# EAGLE design MPU9150 Breakout (EAGLE 6.2)
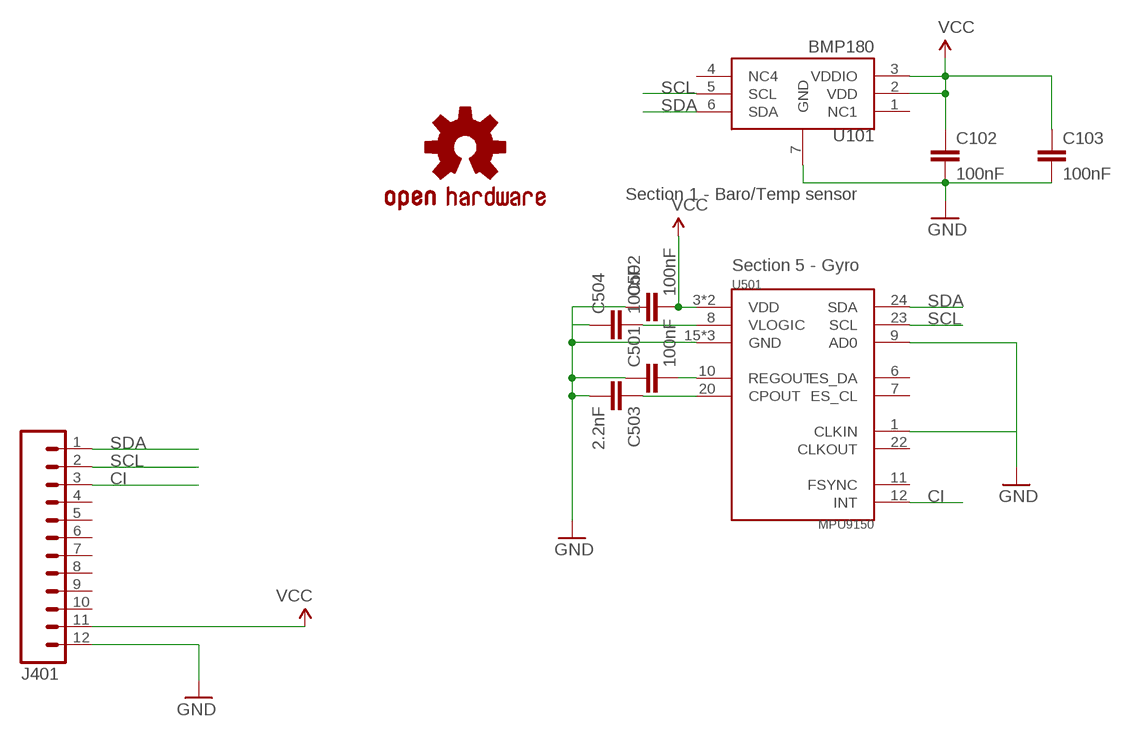
[diagram p0: schematic, sheet 1]

## Parts
C102  100nF  CAP0603-CAP  [0603-CAP]
C103  100nF  CAP0603-CAP  [0603-CAP]
C501  100nF  CAP0603-CAP  [0603-CAP]
C502  100nF  CAP0603-CAP  [0603-CAP]
C503  2.2nF  CAP0603-CAP  [0603-CAP]
C504  100nF  CAP0603-CAP  [0603-CAP]
J401  M12PTH  [1X12]
U101  BMP180  [BMP180]
U501  MPU9150  [LLGA24]
U$2  OSHW-LOGOS  [OSHW-LOGO-S]

## Nets
CI: J401.3 U501.12(INT)
GND: C102.2 C103.2 C501.1 C502.1 C503.2 C504.1 J401.12 U101.7(GND) U501.1(CLKIN) U501.9(AD0) U501.15(GND) U501.17(GND) U501.18(GND)
N$3: C503.1 U501.20(CPOUT)
N$5: C501.2 U501.10(REGOUT)
N$7 [POWER]: C504.2 U501.8(VLOGIC)
SCL: J401.2 U101.5(SCL) U501.23(SCL)
SDA: J401.1 U101.6(SDA) U501.24(SDA)
VCC [POWER]: C102.1 C103.1 C502.2 J401.11 U101.2(VDD) U101.3(VDDIO) U501.3(VDD) U501.13(VDD)
Unconnected: J401.4 J401.5 J401.6 J401.7 J401.8 J401.9 J401.10 U101.1(NC1) U101.4(NC4) U501.6(ES_DA) U501.7(ES_CL) U501.11(FSYNC) U501.22(CLKOUT)

## Notes on the sheet
- Section 1 - Baro/Temp sensor
- Section 5 - Gyro

## Library data of the parts
C102 C103 C501 C502 C504 = SparkFun:CAP: Capacitor Standard 0603 ceramic capacitor, and 0.1" leaded capacitor.; DIGIKEY: 445-1316-1-ND
C503 = SparkFun:CAP: Capacitor Standard 0603 ceramic capacitor, and 0.1" leaded capacitor.; DIGIKEY: 445-5132-1-ND
J401 = SparkFun:M12: Header 12 Standard 12-pin 0.1" header. Use with straight break away headers (SKU : PRT-00116), right angle break away headers (PRT-00553), swiss pins (PRT-00743), machine pins (PRT-00117), and female headers (PRT-00115).; DIGIKEY: $NOPART
U101 = KwanSystems:BMP180; DIGIKEY: 828-1027-1-ND
U501 = KwanSystems:MPU9150
U$2 = SparkFun:OSHW-LOGO: Open Source Hardware Logo This logo indicates the piece of hardware it is found on incorporates a OSHW license and/or adheres to the definition of open source hardware found here: http://freedomdefined.org/OSHW; DIGIKEY: $NOPART

## Net classes
0 default: width 0.152 mm, drill 0.33 mm, clearance 0.152 mm
1 POWER: width 0.152 mm, drill 0.33 mm, clearance 0.152 mm
2 hv: width 0.152 mm, drill 0.33 mm, clearance 0.152 mm

## Board
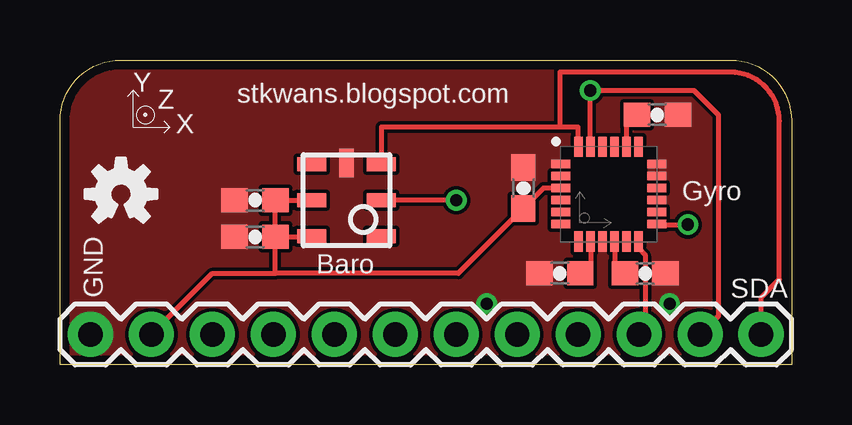
[diagram p1: board, top side]
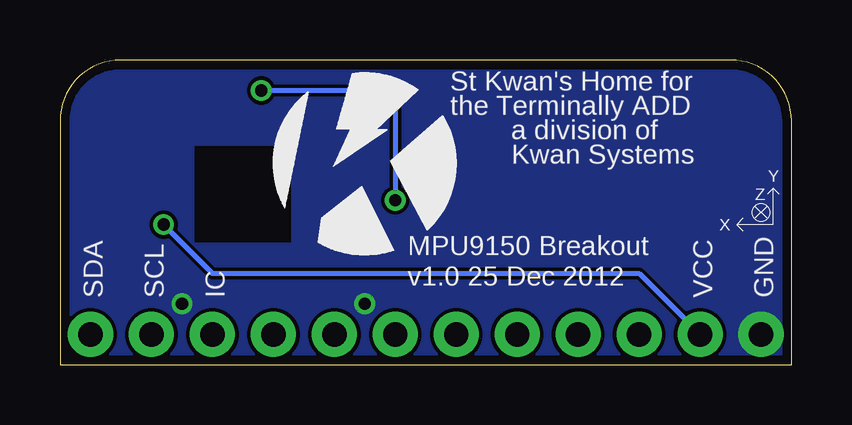
[diagram p2: board, bottom side, seen from below]

Size 30.48 x 12.7 mm. Coordinates in mm from the lower left corner, seen from the top.
Outline: 0,0 0,10.16 arc-90 2.54,12.7 27.94,12.7 arc-90 30.48,10.16 30.48,0 0,0
Copper layers (1*16): Top 0.0356mm / dielectric 1.5011mm / Bottom 0.0356mm
Design rules: minimum track width 6mil, minimum drill 13mil, track to track 6mil, track to pad 6mil, pad to pad 6mil, via to via 6mil, smd to smd 6mil, copper to edge 15mil, drill to drill 6mil, minimum pad ring 7mil, minimum via ring 7mil, stop-mask expansion 4mil, vias tented up to drill 14mil, thermal gap 10mil
vRestrict: area 0.8,2.8 to 1.8,4.8; area 26.2,3.6 to 26.9,4.8; area 27.9,2.8 to 30,3.6; area 28.7,3.6 to 29.5,4.8; area 2,10.4 to 14.2,12.2; area 3,8.4 to 11.7,10.2; area 0.5,6.3 to 1,8.6; area 1,5.8 to 1.5,7.4; area 1.5,5.6 to 2.8,6.1; area 0.5,5.8 to 1.3,7.9; area 14,5.8 to 16.5,10.4; area 15.5,8.4 to 19.1,12.2; 2 more areas

### Footprints (pad centres in the part's own frame; a part is rotated, then mirrored left to right if it is on the bottom)
0603-CAP = smd 1.1 x 1: 1 -0.85,0; 2 0.85,0
1X12 = drill 1.016 pad 1.88: 1 0,0; 2 2.54,0; 3 5.08,0; 4 7.62,0; 5 10.16,0; 6 12.7,0; 7 15.24,0; 8 17.78,0; 9 20.32,0; 10 22.86,0; 11 25.4,0; 12 27.94,0
BMP180 = smd 0.6 x 1.2: 1 1.5,1.45; 2 0,1.45; 3 -1.5,1.45; 4 -1.5,-1.45; 5 0,-1.45; 6 1.5,-1.45 | smd 1.2 x 0.6: 7 1.55,0
LLGA24 = smd 0.8 x 0.35: 1 -2,1.25; 2 -2,0.75; 3 -2,0.25; 4 -2,-0.25; 5 -2,-0.75; 6 -2,-1.25; 13 2,-1.25; 14 2,-0.75; 15 2,-0.25; 16 2,0.25; 17 2,0.75; 18 2,1.25 | smd 0.35 x 0.85: 7 -1.25,-1.975; 8 -0.75,-1.975; 9 -0.25,-1.975; 10 0.25,-1.975; 11 0.75,-1.975; 12 1.25,-1.975; 19 1.25,1.975; 20 0.75,1.975; 21 0.25,1.975; 22 -0.25,1.975; 23 -0.75,1.975; 24 -1.25,1.975

### Placement (x,y rotation side)
C102  8.13,6.86 180 top
C103  8.13,5.33 180 top
C501  24.38,3.81 180 top
C502  19.3,7.37 270 top
C503  24.89,10.41 0 top
C504  20.83,3.81 0 top
J401  29.21,1.27 180 top
U101  11.94,6.86 90 top
U501  22.86,7.11 0 top
U$1  [KWAN_CIRCLE]  17.78,8.38 0 bottom
U$2  2.54,7.11 0 top

### Tracks (layer width: path | path; a pad name or v marks a point on that pad's centre or on a via)
CI
  Top 0.203: U501.12 24.11,4.85 24.38,4.57 24.38,1.52 J401.3
GND  (via drill 0.51)
  other vias: 25.4,2.54 17.78,2.54
  pour Bottom (no thermals): 2.54,12.7 27.94,12.7 arc-90 30.48,10.16 30.48,0 0,0 0,10.16 arc-90
  pour Top (no thermals): 2.54,12.7 27.94,12.7 arc-90 30.48,10.16 30.48,0 0,0 0,10.16 arc-90
N$3
  Top 0.203: U501.20 23.61,9.98 C503.1
N$5
  Top 0.203: U501.10 23.11,4.23 C501.2
N$7
  Top 0.203: U501.8 22.11,4.24 C504.2
SCL  (via drill 0.51)
  Top 0.203: U501.23 22.1,9.09 v22.1,11.43 26.42,11.43 27.43,10.41 27.43,2.03 J401.2 | v16.51,6.86 U101.5
  Bottom 0.203: v16.51,6.86 16.51,10.67 17.27,11.43 v22.1,11.43
SDA
  Top 0.203: U501.24 21.59,9.11 21.59,9.91 20.83,9.91 | 20.83,9.91 13.39,9.91 U101.6 | 20.83,9.91 20.83,11.43 20.83,12.19 27.94,12.19 arc-90 29.97,10.16 29.97,3.56 29.21,2.79 J401.1
VCC  (via drill 0.51)
  Top 0.203: C103.1 10.46,5.33 U101.3 | U101.2 C102.1 C103.1 | J401.11 6.35,3.81 8.98,3.81 | 8.98,3.81 C103.1 | 8.98,3.81 16.6,3.81 C502.2 20.15,7.36 U501.3 | U501.13 25.13,5.86 25.15,5.84 v26.16,5.84
  Bottom 0.203: v26.16,5.84 24.13,3.81 6.35,3.81 J401.11

### Text on the board
tPlace: Y | Z | stkwans.blogspot.com | X | Gyro | Baro | GND | SDA
bPlace: St Kwan's Home for | the Terminally ADD | a division of | Y | Kwan Systems | Z | X | MPU9150 Breakout | GND | VCC | v1.0 25 Dec 2012 | IC | SCL | SDA